# Altium schematic sheet AIWAC_A33_RGB5寸LCD驱动板_20190109.SchDoc
size A3
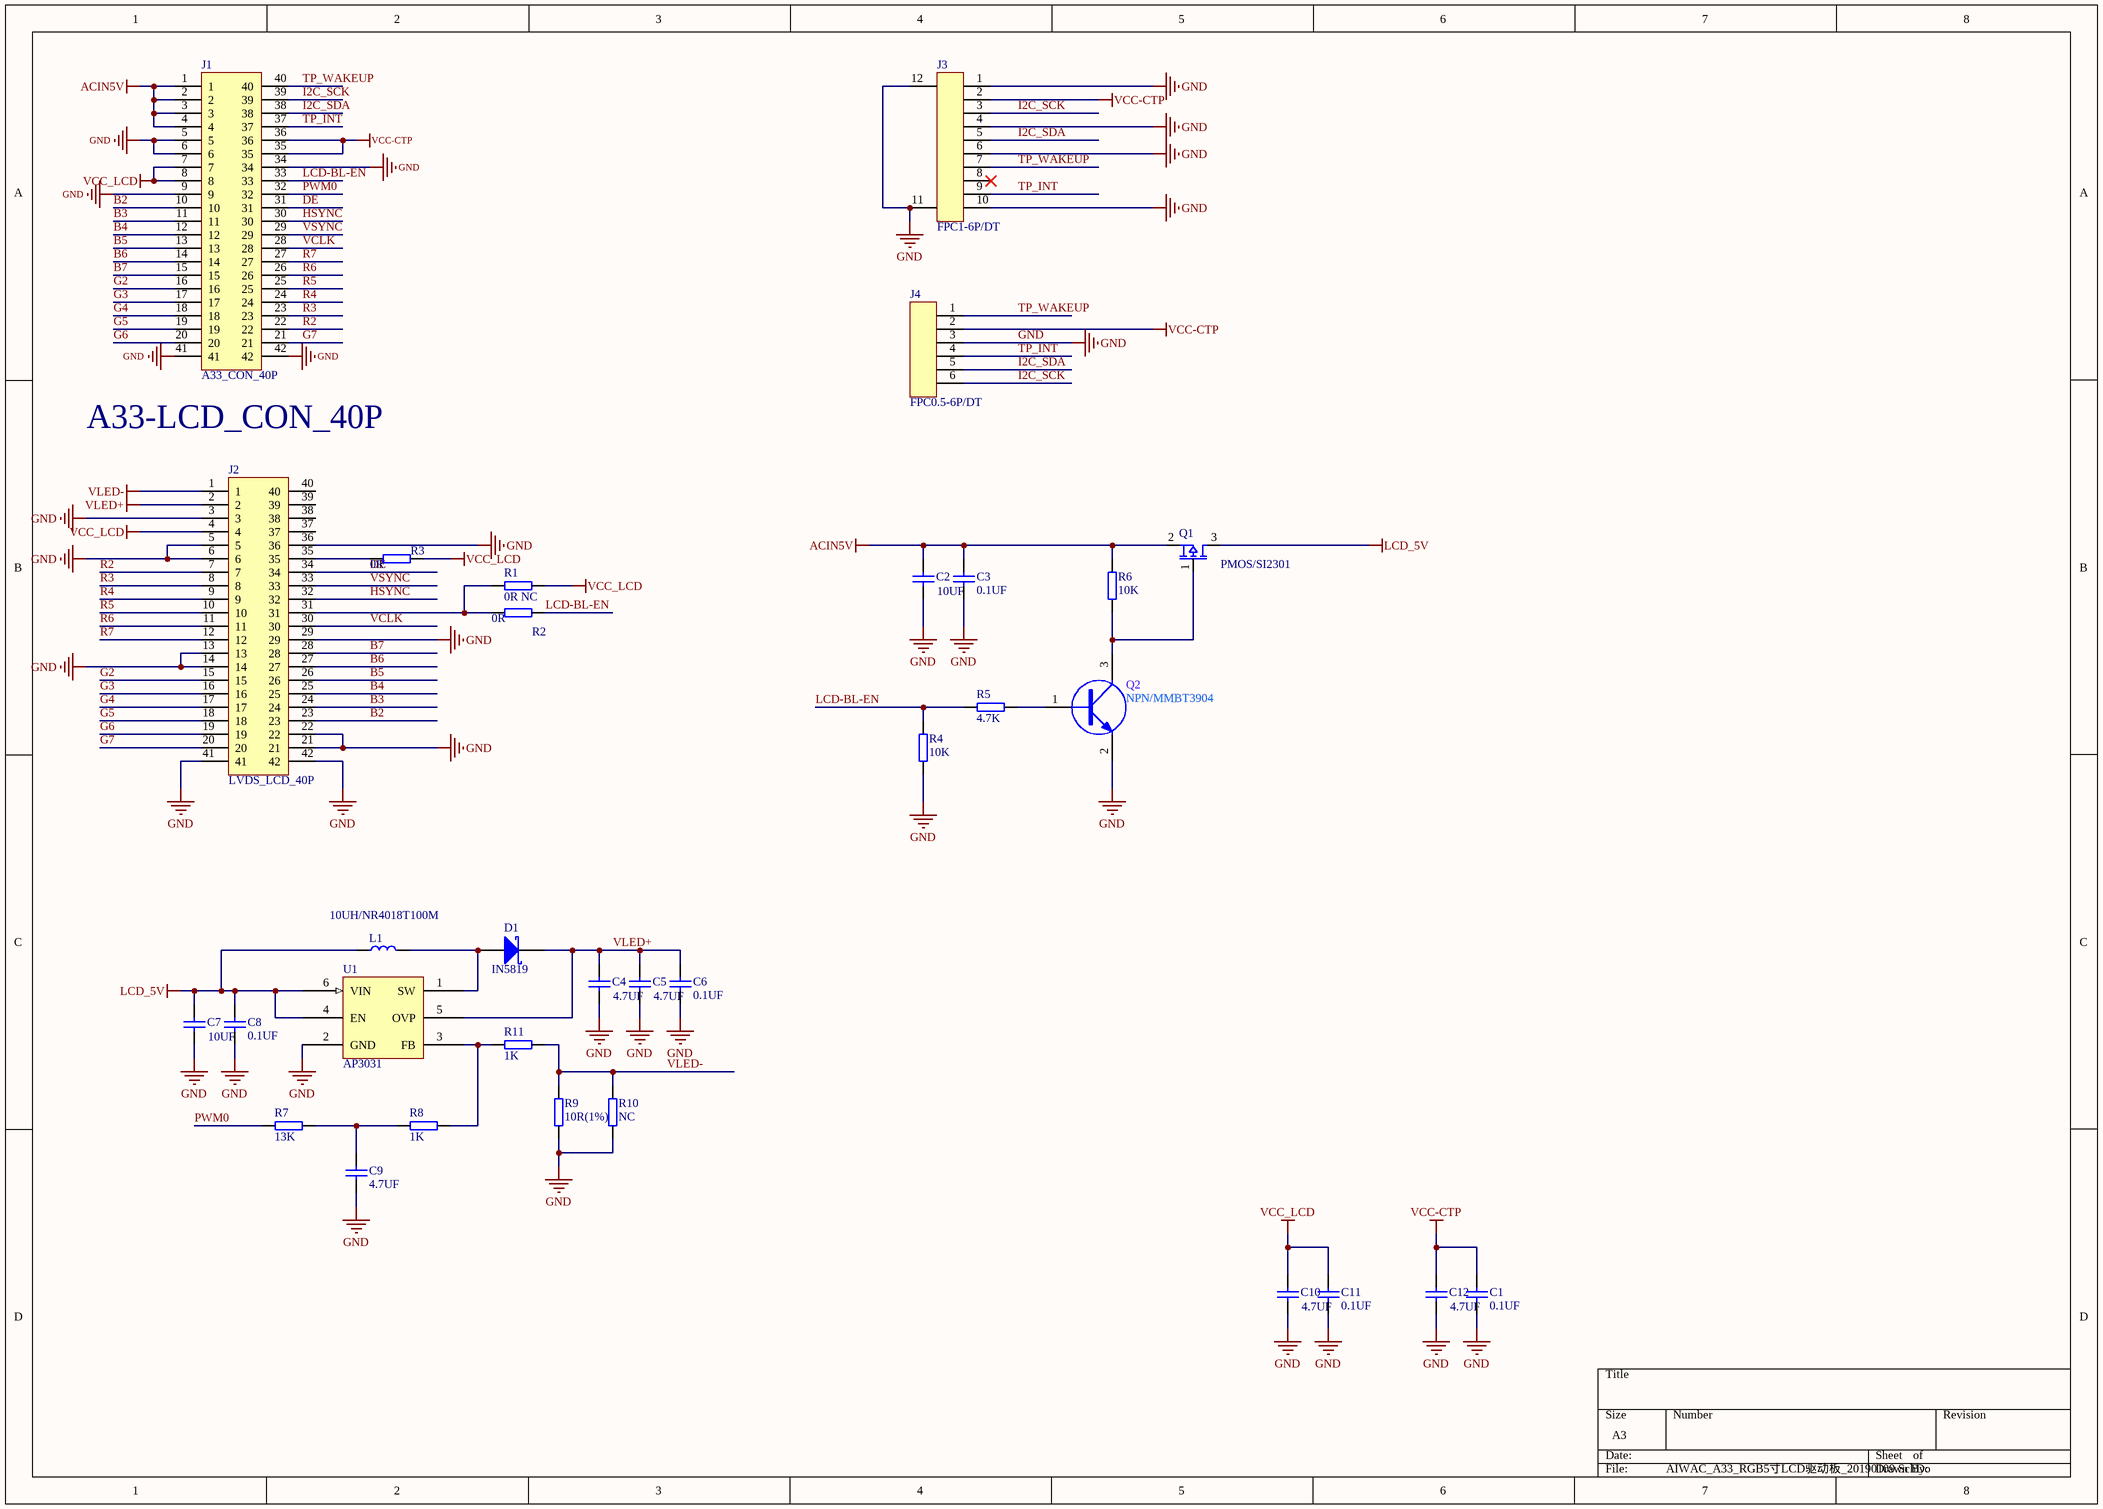
[diagram p0: AIWAC_A33_RGB5寸LCD驱动板_20190109.SchDoc]

## Parts
C1  0.1UF  [C0402]
C2  10UF  [C0805]
C3  0.1UF  [C0402]
C4  4.7UF  [C0805]
C5  4.7UF  [C0805]
C6  0.1UF  [C0402]
C7  10UF  [C0805]
C8  0.1UF  [C0402]
C9  4.7UF  [C0603]
C10  4.7UF  [C0805]
C11  0.1UF  [C0402]
C12  4.7UF  [C0805]
D1  IN5819  [D1206]
J1  A33_CON_40P  [LCD P40]
J2  LVDS_LCD_40P  [FPC-59240HU010R]
J3  FPC1-6P/DT  [FPC0.5-10P/下接]
J4  FPC0.5-6P/DT  [FPC0.5-6P/下接]
L1  10UH/NR4018T100M  [D1206]
Q1  PMOS/SI2301  [U-SOT-23-3]
Q2  NPN/MMBT3904  [U-SOT-23-3]
R1  0R NC  [0402]
R2  0R  [0402]
R3  0R  [0402]
R4  10K  [0402]
R5  4.7K  [0402]
R6  10K  [0402]
R7  13K  [0402]
R8  1K  [0402]
R9  10R(1%)  [0402]
R10  NC  [0402]
R11  1K  [0402]
U1  AP3031  [U-SOT-23-6]

## Nets
ACIN5V: C2.1 C3.1 J1.1 J1.2 J1.3 J1.4 Q1.2 R6.1
GND: C1.2 C2.2 C3.2 C4.2 C5.2 C6.2 C7.2 C8.2 C9.1 C10.2 C11.2 C12.2 J1.5 J1.6 J1.9 J1.34 J1.41 J1.42 J2.3 J2.5 J2.6 J2.13 J2.14 J2.21 J2.22 J2.29 J2.36 J2.41 J2.42 J3.1 J3.4 J3.6 J3.10 J3.11 J3.12 J4.3 Q2.2(E) R4.2 R9.2 R10.2 U1.2(GND)
LCD_5V: C7.1 C8.1 L1.1 Q1.3 U1.4(EN) U1.6(VIN)
VCC-CTP: C1.1 C12.1 J1.35 J1.36 J3.2 J4.2
VCC_LCD: C10.1 C11.1 J1.7 J1.8 J2.4 R1.1 R3.1
VLED+: C4.1 C5.1 C6.1 D1.2(K) J2.2 U1.5(OVP)
VLED-: J2.1 R9.1 R10.1 R11.1
B2: J1.10 J2.23
B3: J1.11 J2.24
B4: J1.12 J2.25
B5: J1.13 J2.26
B6: J1.14 J2.27
B7: J1.15 J2.28
DE: J1.31 J2.34
G2: J1.16 J2.15
G3: J1.17 J2.16
G4: J1.18 J2.17
G5: J1.19 J2.18
G6: J1.20 J2.19
G7: J1.21 J2.20
HSYNC: J1.30 J2.32
I2C_SCK: J1.39 J3.3 J4.6
I2C_SDA: J1.38 J3.5 J4.5
LCD-BL-EN: J1.33 R2.1 R4.1 R5.2
PWM0: J1.32 R7.2
R2: J1.22 J2.7
R3: J1.23 J2.8
R4: J1.24 J2.9
R5: J1.25 J2.10
R6: J1.26 J2.11
R7: J1.27 J2.12
TP_INT: J1.37 J3.9 J4.4
TP_WAKEUP: J1.40 J3.7 J4.1
VCLK: J1.28 J2.30
VSYNC: J1.29 J2.33
NetC9_2: C9.2 R7.1 R8.2
NetD1_1: D1.1(A) L1.2 U1.1(SW)
NetJ2_31: J2.31 R1.2 R2.2
NetJ2_35: J2.35 R3.2
NetQ1_1: Q1.1 Q2.3(C) R6.2
NetQ2_1: Q2.1(B) R5.1
NetR8_1: R8.1 R11.2 U1.3(FB)

Not connected (* = marked no-connect by the designer): J2 37 38 39 40; J3 8(6)*

## Notes on the sheet
- A33-LCD_CON_40P

## Library data of the parts
C1 C3 C6 C8 C11 = C0402X7R-104J10V: 贴片电容-陶瓷; 规格型号: 100nF±5%_10V_X7R_C0402; 生产商: 风华 三星; 供应商: *; 备注: *
C2 C4 C5 C7 C10 C12 = C0805X7R-226K25V: 贴片电容-陶瓷; 规格型号: 22uF±10%_25V_X7R_C0805; 生产商: 风华 三星; 供应商: *; 备注: *
C9 = C0603X7R-330J25V: 贴片电容-陶瓷; 规格型号: 33pF±5%_25V_X7R_C0603; 生产商: 风华 三星; 供应商: *; 备注: *
D1 = D Schottky: Schottky Diode; Published: 8-Jun-2000; LatestRevisionDate: 17-Jul-2002; LatestRevisionNote: Re-released for DXP Platform.; PackageReference: SMB; Publisher: Altium Limited; Code_JEDEC: DO-214-AA
J1 J2 = LCD_40P
J3 = J-FPC0.5-10P/DT: FPC端子; 规格型号: FPC0.5-6P/DT 6P 脚间距0.5mm 下接触 抽屉式; 货品编码: 样品无编码; 供应商: *; 备注: *
J4 = J-FPC0.5-6P/DT: FPC端子; 规格型号: FPC0.5-6P/DT 6P 脚间距0.5mm 下接触 抽屉式; 货品编码: 样品无编码; 供应商: *; 备注: *
L1 = 3.3uH: 贴片电感-屏蔽; 生产商: *; 供应商: *; 备注: *
Q1 = PMOS: 贴片MOSFET管; 规格型号: AP2309AGN-HF; 货品编码: 331010; 生产商: Advanced Power; 备注: *; 供应商: *
Q2 = SS8050 TO-23: 三极管; 单价: 0.031
R1-R11 = R0603-10KF: 贴片电阻-通用; 生产商: 厚声 国巨; 规格型号: 10K±1%_1/10W_±200ppm_R0402; 备注: *; 供应商: *